# Altium schematic sheet InputConnectors.SchDoc
size A
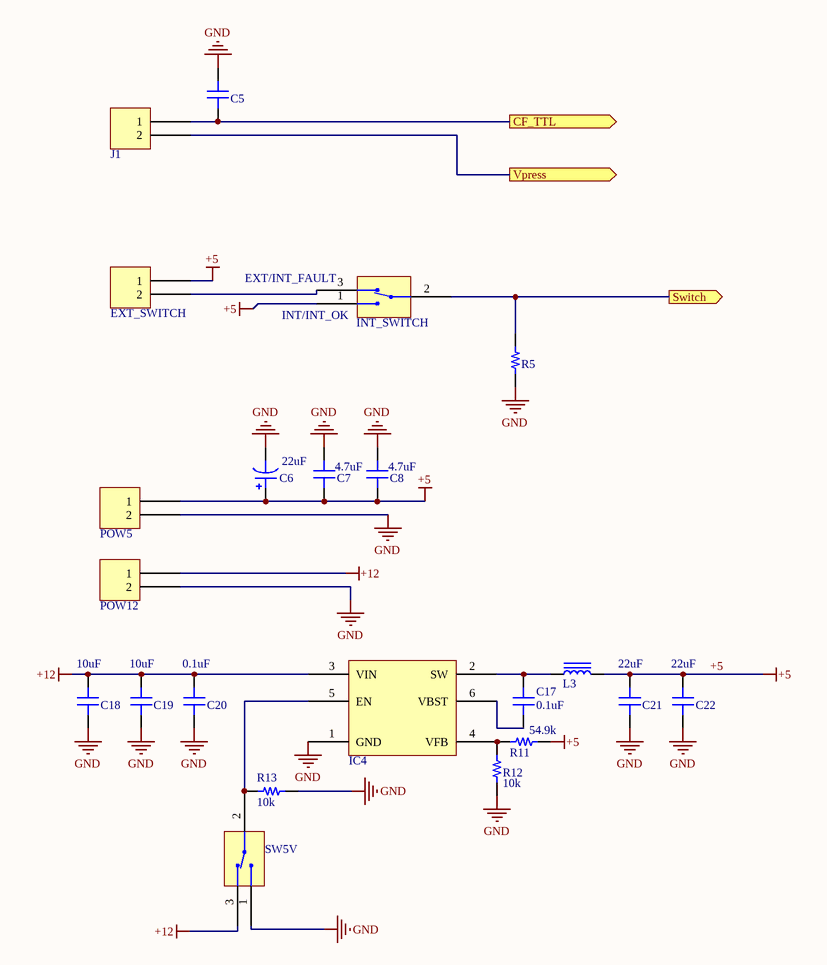
[diagram p0: InputConnectors.SchDoc]

## Parts
C5  10000pF  [CAP 0805/2012]  (value not drawn)
C6  22uF  [CAP AL TH D8 L3.5 H11.5]
C7  4.7uF  [CAP 1206/3216 - 1.0MM]
C8  4.7uF  [CAP 1206/3216 - 1.0MM]
C17  0.1uF  [CAP 0805/2012]
C18  10uF  [CAP 1206/3216]
C19  10uF  [CAP 1206/3216]
C20  0.1uF  [CAP 0805/2012]
C21  22uF  [CAP 1206/3216]
C22  22uF  [CAP 1206/3216]
EXT_SWITCH  282834-2  [TE 282834-2]  (value not drawn)
IC4  TPS563201DDCT  [TI SOT-23-6 DDC]  (value not drawn)
INT_SWITCH  CL-SB-12B-01T  [SW_CL-SB-12B-01]  (value not drawn)
J1  282834-2  [TE 282834-2]  (value not drawn)
L3  3.3uH  [WURTH WE-HCI 7050]  (value not drawn)
POW5  282834-2  [TE 282834-2]  (value not drawn)
POW12  282834-2  [TE 282834-2]  (value not drawn)
R5  10k  [RES 1206/3216]  (value not drawn)
R11  54.9k  [RES 0805/2012]
R12  10k  [RES 0805/2012]
R13  10k  [RES 0805/2012]
SW5V  CL-SB-12B-01T  [SW_CL-SB-12B-01]  (value not drawn)

## Ports
CF_TTL (out), Switch (out), Vpress (out)

## Nets
+5: C6.1 C7.1 C8.1 C21.2 C22.2 EXT_SWITCH.1 INT_SWITCH.1(GND) L3.2 POW5.1 R11.2
+12: C18.2 C19.2 C20.2 IC4.3(VIN) POW12.1 SW5V.3(GND)
GND: C5.2 C6.2 C7.2 C8.2 C18.1 C19.1 C20.1 C21.1 C22.1 IC4.1(GND) POW5.2 POW12.2 R5.1 R12.1 R13.1 SW5V.1(GND)
CF_TTL: C5.1 J1.1 ; port CF_TTL
Switch: INT_SWITCH.2(GND) R5.2 ; port Switch
Vpress: J1.2 ; port Vpress
NetC17_1: C17.1 IC4.6(VBST)
NetC17_2: C17.2 IC4.2(SW) L3.1
NetEXT_SWITCH_2: EXT_SWITCH.2 INT_SWITCH.3(GND)
NetIC4_4: IC4.4(VFB) R11.1 R12.2
NetIC4_5: IC4.5(EN) R13.2 SW5V.2(GND)

## Notes on the sheet
- (near INT_SWITCH) EXT/INT_FAULT
- (near INT_SWITCH) INT/INT_OK

## Library data of the parts
C5 = CL21B103KAANNNC: CAP CER 10000PF 25V X7R 0805; Manufacturer: Samsung Electro-Mechanics America, Inc.; TemperatureRange: -55C ~ 125C; Tolerance: 10%; Value: 10000pF; Part Number: CL21B103KAANNNC; PartId: 5695; Supplier 1: Digi-Key; Supplier Part Number 1: 1276-2434-2-ND; ComponentLink1Description: Datasheet; ComponentLink1URL: http://www.samsungsem.com/kr/support/product-search/mlcc/CL21B103KAANNNC.jsp; ComponentLink2Description: Digi-Key listing; ComponentLink2URL: http://digikey.com/product-detail/en/CL21B103KAANNNC/1276-2434-2-ND/3888092; TemperatureCoefficient: X7R; Voltage: 25V; Price: 0.0081; Type: -; Device Package: 0805 (2012 Metric)
C6 = EEU-FC2A220: CAP ALUM 22UF 20% 100V RADIAL; Manufacturer: Panasonic Electronic Components; TemperatureRange: -55°C ~ 105°C; Type: Automotive; Ripple Current: 169mA; Lifetime @ Temp: 2000 Hrs @ 105°C; Value: 22uF; Part Number: EEU-FC2A220; PartId: 7484; Supplier 1: Digi-Key; Supplier Part Number 1: P10770-ND; ComponentLink1Description: Datasheet; ComponentLink1URL: https://industrial.panasonic.com/ww/products/capacitors/aluminum-capacitors/aluminum-cap-lead/fc/EEUFC2A220; ComponentLink2Description: Digi-Key listing; ComponentLink2URL: https://www.digikey.com/product-detail/en/panasonic-electronic-components/EEU-FC2A220/P10770-ND/285722; Tolerance: 20%; Voltage: 100V; Price: 0.46; Device Package: Radial, Can - TH
C7 C8 = C3216X5R1H475K085AB: CAP CER 4.7UF 50V X5R 1206; Manufacturer: TDK Corporation; TemperatureRange: -55C ~ 85C; Tolerance: 10%; Value: 4.7uF; Part Number: C3216X5R1H475K085AB; PartId: 17022; Supplier 1: Digi-Key; Supplier Part Number 1: 445-14692-2-ND; ComponentLink1Description: Datasheet; ComponentLink1URL: https://product.tdk.com/info/en/catalog/datasheets/mlcc_commercial_general_en.pdf; ComponentLink2Description: Digi-Key Listing; ComponentLink2URL: https://www.digikey.com/product-detail/en/tdk-corporation/C3216X5R1H475K085AB/445-14692-2-ND/3951928; TemperatureCoefficient: X5R; Voltage: 50V; Price: 0.3159; Device Package: 1206 (3216 Metric)
C17 C20 = CL21B104KACNNNC: CAP CER 0.1UF 25V X7R 0805; Manufacturer: Samsung Electro-Mechanics America, Inc.; TemperatureRange: -55C ~ 125C; Tolerance: 10%; Value: 0.1uF; Part Number: CL21B104KACNNNC; PartId: 5699; Supplier 1: Digi-Key; Supplier Part Number 1: 1276-1099-2-ND; ComponentLink1Description: Datasheet; ComponentLink1URL: http://www.samsungsem.com/kr/support/product-search/mlcc/CL21B104KACNNNC.jsp; ComponentLink2Description: Digi-Key listing; ComponentLink2URL: http://digikey.com/product-detail/en/CL21B104KACNNNC/1276-1099-2-ND/3886757; TemperatureCoefficient: X7R; Voltage: 25V; Price: 0.0099; Device Package: 0805 (2012 Metric); Type: -
C18 C19 = C1206C106M3RACTU: CAP CER 10UF 25V X7R 1206; Manufacturer: Kemet; TemperatureRange: -55C ~ 125C; Tolerance: 20%; Value: 10uF; Part Number: C1206C106M3RACTU; PartId: 6235; Supplier 1: Digi-Key; Supplier Part Number 1: 399-7443-2-ND; ComponentLink1Description: Datasheet; ComponentLink1URL: http://www.kemet.com/docfinder?Partnumber=C1206C106M3RACTU; ComponentLink2Description: Digi-Key listing; ComponentLink2URL: http://digikey.com/product-detail/en/C1206C106M3RACTU/399-7443-2-ND/3317649; TemperatureCoefficient: X7R; Voltage: 25V; Price: 0.2272; Type: -; Device Package: 1206 (3216 Metric)
C21 C22 = CL31A226KAHNNNE: CAP CER 22UF 25V X5R 1206; Manufacturer: Samsung Electro-Mechanics America, Inc.; TemperatureRange: -55C ~ 85C; Tolerance: 10%; Value: 22uF; Part Number: CL31A226KAHNNNE; PartId: 15794; Supplier 1: Digi-Key; Supplier Part Number 1: 1276-3047-2-ND; ComponentLink1Description: Datasheet; ComponentLink1URL: //media.digikey.com/pdf/Data%20Sheets/Samsung%20PDFs/CL31A226KAHNNNE_Spec.pdf; ComponentLink2Description: Digi-Key Listing; ComponentLink2URL: https://www.digikey.com/product-detail/en/samsung-electro-mechanics-america-inc/CL31A226KAHNNNE/1276-3047-2-ND/3888705; TemperatureCoefficient: X5R; Voltage: 25V; Price: 0.1785; Device Package: 1206 (3216 Metric)
EXT_SWITCH J1 POW5 POW12 = 282834-2: TERM BLOCK 2POS SIDE ENT 2.54MM; Manufacturer: TE Connectivity AMP Connectors; TemperatureRange: -40C ~ 105C; Voltage: 150V; Pitch: 0.100" (2.54mm); Number Of Levels: 1; Positions Per Level: 2; Part Number: 282834-2; PartId: 9289; Supplier 1: Digi-Key; Supplier Part Number 1: A98333-ND; ComponentLink1Description: Datasheet; ComponentLink1URL: http://www.te.com/commerce/DocumentDelivery/DDEController?Action=srchrtrv&DocNm=282834&DocType=Customer+Drawing&DocLang=English; ComponentLink2Description: Digi-Key Listing; ComponentLink2URL: http://www.digikey.ca/product-detail/en/282834-2/A98333-ND/1150135; Price: 1.3; Colour: Green; Orientation: Horizontal with Board
IC4 = TPS563201DDCT: IC REG BUCK ADJ 3A SYNC; Manufacturer: Texas Instruments; Function: Step-Down; Output Configuration: Positive; Output Type: Adjustable; Number Of Outputs: 1; Voltage - Input (Min): 4.5V; Voltage - Input (Max): 17V; Voltage - Output (Min/Fixed): 0.768V; Voltage - Output (Max): 7V; Frequency - Switching: 580kHz; Synchronous Rectifier: Yes; Part Number: TPS563201DDCT; PartId: 16367; Supplier 1: Digi-Key; Supplier Part Number 1: 296-43393-2-ND; ComponentLink1Description: Datasheet; ComponentLink1URL: http://www.ti.com/lit/ds/symlink/tps563201.pdf; ComponentLink2Description: Digi-Key Listing; ComponentLink2URL: http://www.digikey.com/product-detail/en/texas-instruments/TPS563201DDCT/296-43393-2-ND/5813458; Device Package: SOT-23-6 Thin, TSOT-23-6; Price: 0.8901; Type: DC DC Switching Regulators; Series: D-CAP2, Eco-Mode; Operating Temperature: -45C ~ 125C (TJ); Topology: Buck; Current Output: 3A
INT_SWITCH SW5V = CL-SB-12B-01T: SWITCH SLIDE SPDT 200MA 12V; Manufacturer: Nidec Copal Electronics; Switch Function: On-On; Actuator Type: Standard; Switch Travel: 2.00mm; Mechanical Life: 10,000 Cycles; Part Number: CL-SB-12B-01T; PartId: 16472; Supplier 1: Digi-Key; Supplier Part Number 1: 563-1318-1-ND; ComponentLink1Description: Datasheet; ComponentLink1URL: https://www.nidec-copal-electronics.com/e/catalog/switch/cl-sb.pdf; ComponentLink2Description: Digi-Key Listing; ComponentLink2URL: https://www.digikey.com/product-detail/en/nidec-copal-electronics/CL-SB-12B-01T/563-1318-1-ND/3507878; Price: 0.9; TYPE: Slide Switches; Series: CL-SB; Circuit: SPDT; Operating Temperature: -40°C ~ 85°C
L3 = 744314330: FIXED IND 3.3UH 9A 9 MOHM SMD; Manufacturer: Wurth Electronics Inc; Type: Wirewound; Tolerance: 20%; Shielding: Shielded; DC Resistance (DCR): 9 mOhm; Frequency - Self Resonant: 65MHz; Value: 3.3uH; Part Number: 744314330; PartId: 9675; Supplier 1: Digi-Key; Supplier Part Number 1: 732-1160-2-ND; ComponentLink1Description: Datasheet; ComponentLink1URL: http://katalog.we-online.de/pbs/datasheet/744314330.pdf; ComponentLink2Description: Digi-Key Listing; ComponentLink2URL: https://www.digikey.com/product-detail/en/744314330/732-1160-2-ND/1638565; Price: 2.85; Device Package: Nonstandard; Series: WE-HCI; Inductance: 3.3uH; Current Rating: 9A; Q @ Freq: -; Operating Temperature: -40C ~ 150C
R5 = ERJ-8ENF1002V: RES SMD 10K OHM 1% 1/4W 1206; Manufacturer: Panasonic Electronic Components; TemperatureRange: -55C ~ 155C; TemperatureCoefficient: 100ppm/C; PowerRating: 0.25W, 1/4W; Value: 10k; Part Number: ERJ-8ENF1002V; PartId: 2956; Supplier 1: Digi-Key; Supplier Part Number 1: P10.0KFTR-ND; ComponentLink1Description: Datasheet; ComponentLink1URL: http://industrial.panasonic.com/www-cgi/jvcr13pz.cgi?E+PZ+3+AOA0002+ERJ8ENF1002V+7+WW; ComponentLink2Description: Digi-Key listing; ComponentLink2URL: http://digikey.com/product-detail/en/ERJ-8ENF1002V/P10.0KFTR-ND/89059; Tolerance: 1%; Price: 0.0093; Type: Thick Film; Device Package: 1206 (3216 Metric)
R11 = ERJ-P06D5492V: RES SMD 54.9K OHM 0.5% 1/2W 0805; Manufacturer: Panasonic Electronic Components; TemperatureRange: -55C ~ 155C; TemperatureCoefficient: 100ppm/C; PowerRating: 0.5W, 1/2W; Value: 54.9k; Part Number: ERJ-P06D5492V; PartId: 12299; Supplier 1: Digi-Key; Supplier Part Number 1: P16052TR-ND; ComponentLink1Description: Datasheet; ComponentLink1URL: //media.digikey.com/pdf/Data%20Sheets/Panasonic%20Electronic%20Components/ERJ_PA2_P03_PA3_P06_P08_P14.pdf; ComponentLink2Description: Digi-Key Listing; ComponentLink2URL: https://www.digikey.com/product-detail/en/panasonic-electronic-components/ERJ-P06D5492V/P16052TR-ND/3982693; Tolerance: 0.5%; Price: 0.0342; Device Package: 0805 (2012 Metric)
R12 R13 = ERJ-P06F1002V: RES SMD 10K OHM 1% 1/2W 0805; Manufacturer: Panasonic Electronic Components; TemperatureRange: -55C ~ 155C; TemperatureCoefficient: 100ppm/C; PowerRating: 0.5W, 1/2W; Value: 10k; Part Number: ERJ-P06F1002V; PartId: 12237; Supplier 1: Digi-Key; Supplier Part Number 1: P16059TR-ND; ComponentLink1Description: Datasheet; ComponentLink1URL: //media.digikey.com/pdf/Data%20Sheets/Panasonic%20Electronic%20Components/ERJ_PA2_P03_PA3_P06_P08_P14.pdf; ComponentLink2Description: Digi-Key Listing; ComponentLink2URL: https://www.digikey.com/product-detail/en/panasonic-electronic-components/ERJ-P06F1002V/P16059TR-ND/3982700; Tolerance: 1%; Price: 0.0192; Device Package: 0805 (2012 Metric)